# EAGLE design Varmo - Rev A1 (EAGLE 7.5.0)
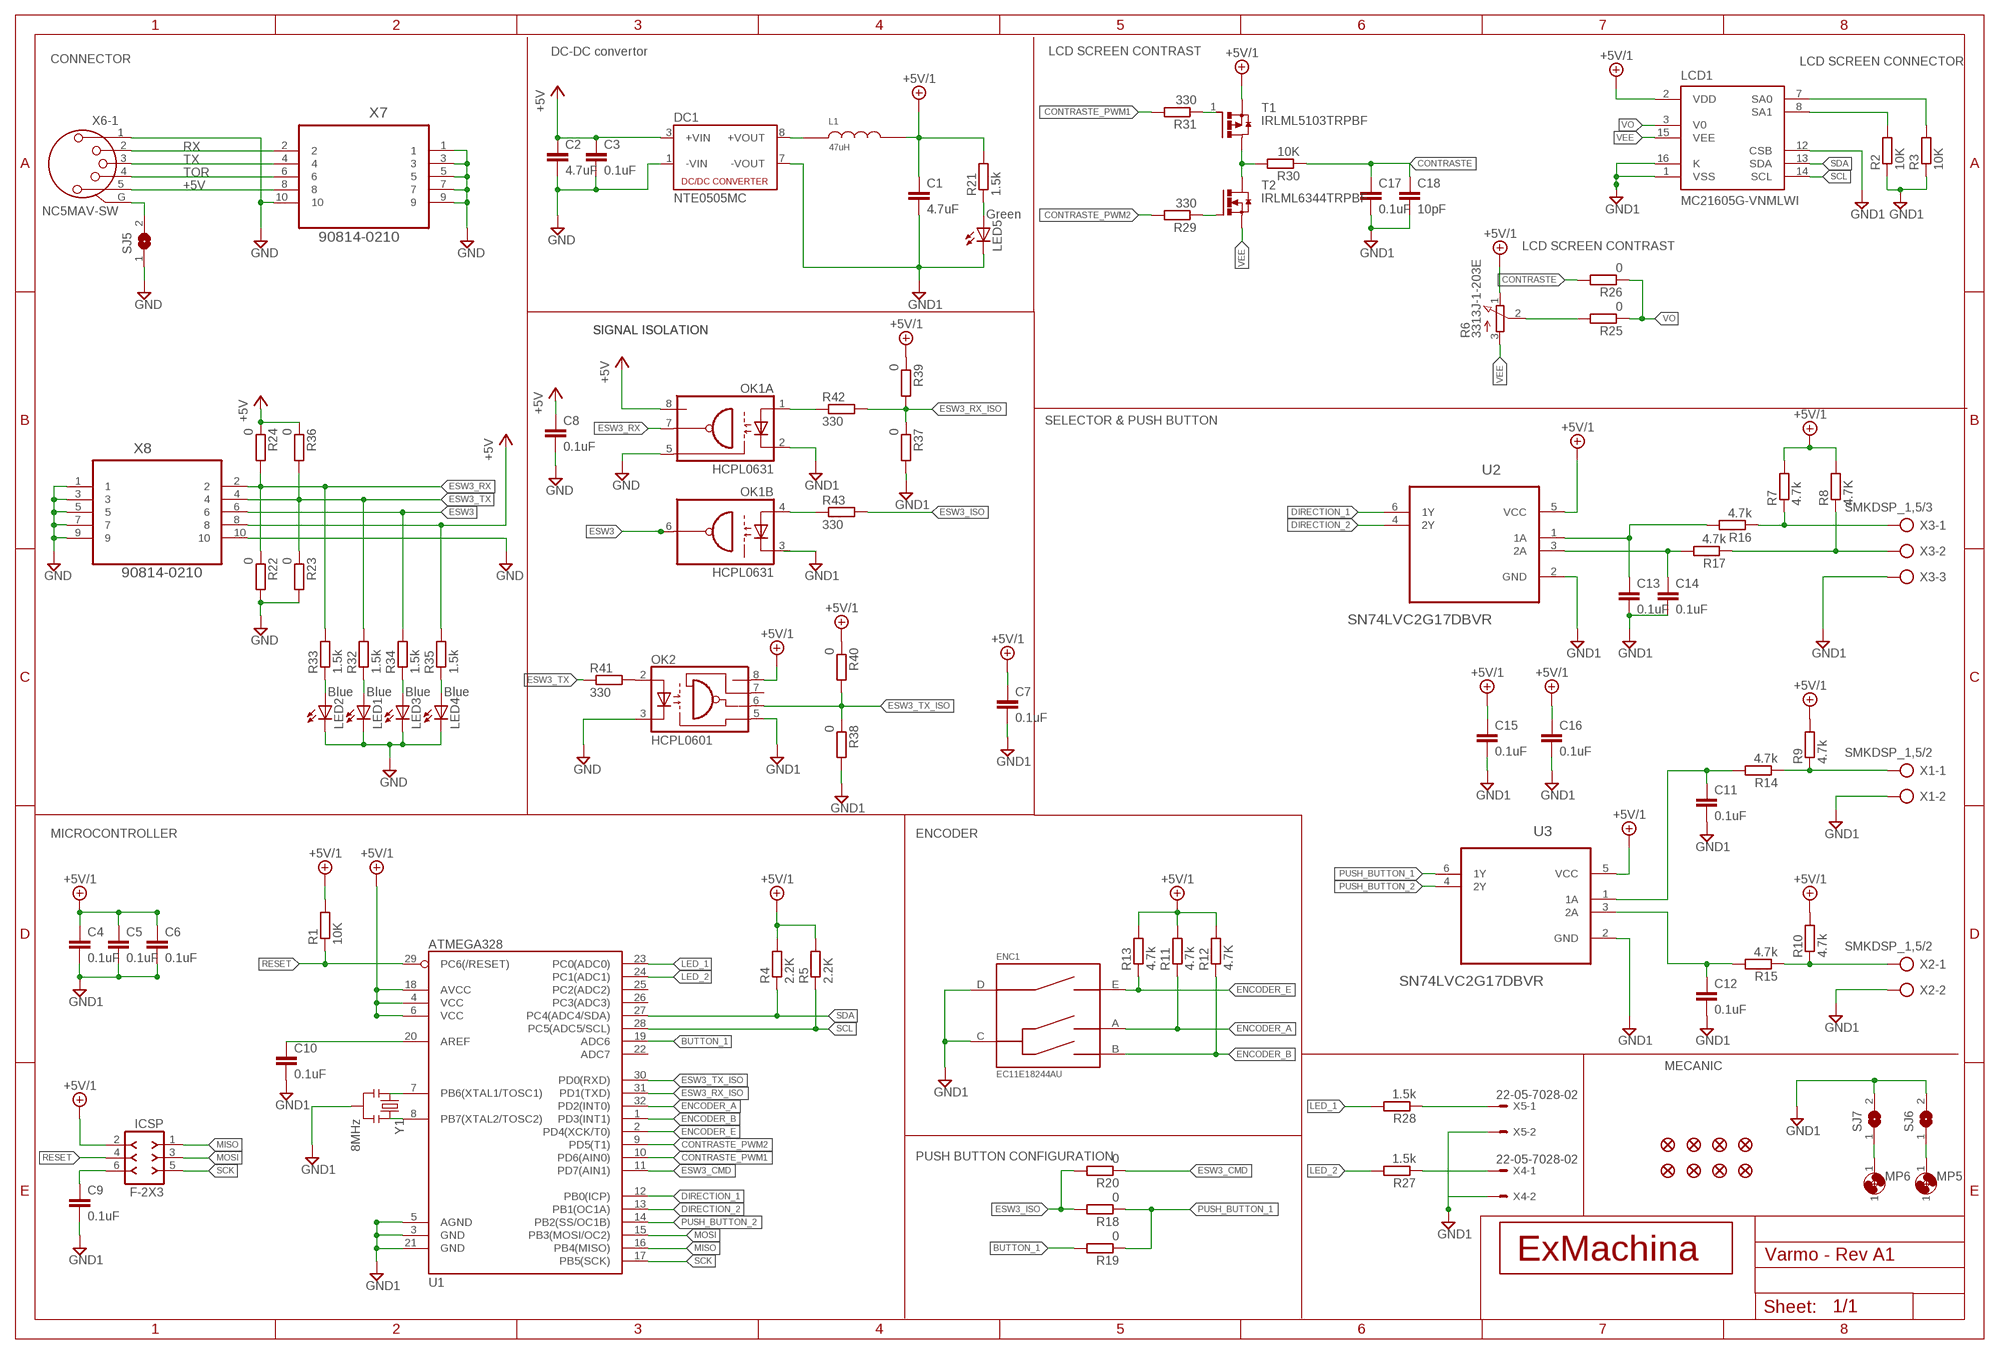
[diagram p0: schematic, sheet 1]

## Parts
C1  4.7uF  C-EUC0603  [C0603]
C2  4.7uF  C-EUC0603  [C0603]
C3  0.1uF  C-EUC0603  [C0603]
C4  0.1uF  C-EUC0603  [C0603]
C5  0.1uF  C-EUC0603  [C0603]
C6  0.1uF  C-EUC0603  [C0603]
C7  0.1uF  C-EUC0603  [C0603]
C8  0.1uF  C-EUC0603  [C0603]
C9  0.1uF  C-EUC0603  [C0603]
C10  0.1uF  C-EUC0603  [C0603]
C11  0.1uF  C-EUC0603  [C0603]
C12  0.1uF  C-EUC0603  [C0603]
C13  0.1uF  C-EUC0603  [C0603]
C14  0.1uF  C-EUC0603  [C0603]
C15  0.1uF  C-EUC0603  [C0603]
C16  0.1uF  C-EUC0603  [C0603]
C17  0.1uF  C-EUC0603  [C0603]
C18  10pF  C-EUC0603  [C0603]
DC1  NTE0505MC  [NTE]
ENC1  EC11E18244AU  [EC11E]
ICSP  F-2X3  [DIL-100-2X3]
JP3  FIDUCIAL1X2  [FIDUCIAL-1X2]
JP4  FIDUCIAL1X2  [FIDUCIAL-1X2]
JP5  FIDUCIAL1X2  [FIDUCIAL-1X2]
JP6  FIDUCIAL1X2  [FIDUCIAL-1X2]
JP7  FIDUCIAL1X2  [FIDUCIAL-1X2]
JP8  FIDUCIAL1X2  [FIDUCIAL-1X2]
JP9  FIDUCIAL1X2  [FIDUCIAL-1X2]
JP10  FIDUCIAL1X2  [FIDUCIAL-1X2]
L1  47uH  82473C  [8200]
LCD1  MC21605G-VNMLWI  [MC21605G]
LED1  Blue  LEDCHIP-LED0603  [CHIP-LED0603]
LED2  Blue  LEDCHIP-LED0603  [CHIP-LED0603]
LED3  Blue  LEDCHIP-LED0603  [CHIP-LED0603]
LED4  Blue  LEDCHIP-LED0603  [CHIP-LED0603]
LED5  Green  LEDCHIP-LED0603  [CHIP-LED0603]
MP5  MOUNT-PAD2.5  [P2.5]
MP6  MOUNT-PAD2.5  [P2.5]
OK1  HCPL0631  [SOIC08]
OK2  HCPL0601  [SOIC08]
R1  10K  R-EU_R0603  [R0603]
R2  10K  R-EU_R0603  [R0603]
R3  10K  R-EU_R0603  [R0603]
R4  2.2K  R-EU_R0603  [R0603]
R5  2.2K  R-EU_R0603  [R0603]
R6  3313J-1-203E  [3313J]
R7  4.7k  R-EU_R0603  [R0603]
R8  4.7K  R-EU_R0603  [R0603]
R9  4.7k  R-EU_R0603  [R0603]
R10  4.7k  R-EU_R0603  [R0603]
R11  4.7k  R-EU_R0603  [R0603]
R12  4.7K  R-EU_R0603  [R0603]
R13  4.7k  R-EU_R0603  [R0603]
R14  4.7k  R-EU_R0603  [R0603]
R15  4.7k  R-EU_R0603  [R0603]
R16  4.7k  R-EU_R0603  [R0603]
R17  4.7k  R-EU_R0603  [R0603]
R18  0  R-EU_R0603  [R0603]
R19  0  R-EU_R0603  [R0603]
R20  0  R-EU_R0603  [R0603]
R21  1.5k  R-EU_R0603  [R0603]
R22  0  R-EU_R0603  [R0603]
R23  0  R-EU_R0603  [R0603]
R24  0  R-EU_R0603  [R0603]
R25  0  R-EU_R0603  [R0603]
R26  0  R-EU_R0603  [R0603]
R27  1.5k  R-EU_R0603  [R0603]
R28  1.5k  R-EU_R0603  [R0603]
R29  330  R-EU_R0603  [R0603]
R30  10K  R-EU_R0603  [R0603]
R31  330  R-EU_R0603  [R0603]
R32  1.5k  R-EU_R0603  [R0603]
R33  1.5k  R-EU_R0603  [R0603]
R34  1.5k  R-EU_R0603  [R0603]
R35  1.5k  R-EU_R0603  [R0603]
R36  0  R-EU_R0603  [R0603]
R37  0  R-EU_R0603  [R0603]
R38  0  R-EU_R0603  [R0603]
R39  0  R-EU_R0603  [R0603]
R40  0  R-EU_R0603  [R0603]
R41  330  R-EU_R0603  [R0603]
R42  330  R-EU_R0603  [R0603]
R43  330  R-EU_R0603  [R0603]
SJ5  SJ  [SJ]
SJ6  SJ  [SJ]
SJ7  SJ  [SJ]
T1  IRLML5103TRPBF  [SOT95P240X112-3N]
T2  IRLML6344TRPBF  [SOT95P240X112-3N]
U1  ATMEGA328  ATMEGA168  [TQFP32-08]
U2  SN74LVC2G17DBVR  [SOT95P280X145-6N]
U3  SN74LVC2G17DBVR  [SOT95P280X145-6N]
U$6  EXMACHINA-LOGO-NAME  [EXM-LOGO-BASELINE]
X1  SMKDSP_1,5/2  [SMKDSP_1,5/2]
X2  SMKDSP_1,5/2  [SMKDSP_1,5/2]
X3  SMKDSP_1,5/3  [SMKDSP_1,5/3]
X4  22-05-7028-02  [7395-02]
X5  22-05-7028-02  [7395-02]
X6  NC5MAV-SW  [NC5MAV-SW]
X7  90814-0210  [MOLEX_90814-0210]
X8  90814-0210  [MOLEX_90814-0210]
Y1  8MHz  RESONATORSMD  [RESONATOR-SMD]

## Nets
+5V: C2.1 C3.1 C8.1 DC1.3(+VIN) OK1.8(A:VCC) R24.1 R35.2 R36.1 X6.5 X7.8 X8.8
+5V/1: C1.1 C4.1 C5.1 C6.1 C7.1 C15.1 C16.1 ICSP.2 L1.2 LCD1.2(VDD) OK2.8(VCC) R1.2 R4.2 R5.2 R6.1(E) R7.2 R8.2 R9.2 R10.2 R11.2 R12.2 R13.2 R21.2 R39.1 R40.1 T1.2(S) U1.4(VCC) U1.6(VCC) U1.18(AVCC) U2.5(VCC) U3.5(VCC)
BUTTON_1: R19.2 U1.19(ADC6)
CONTRASTE: C17.1 C18.1 R26.2 R30.1
CONTRASTE_PWM1: R31.2 U1.10(PD6(AIN0))
CONTRASTE_PWM2: R29.2 U1.9(PD5(T1))
DIRECTION_1: U1.12(PB0(ICP)) U2.6(1Y)
DIRECTION_2: U1.13(PB1(OC1A)) U2.4(2Y)
ENCODER_A: ENC1.A R11.1 U1.32(PD2(INT0))
ENCODER_B: ENC1.B R12.1 U1.1(PD3(INT1))
ENCODER_E: ENC1.E R13.1 U1.2(PD4(XCK/T0))
ESW3: OK1.6(B:VO2) R34.2 X8.6
ESW3_CMD: R20.1 U1.11(PD7(AIN1))
ESW3_ISO: R18.2 R20.2 R43.2
ESW3_RX: OK1.7(A:VO) R22.1 R24.2 R33.2 X8.2
ESW3_RX_ISO: R37.1 R39.2 R42.2 U1.31(PD1(TXD))
ESW3_TX: R23.1 R32.2 R36.2 R41.1 X8.4
ESW3_TX_ISO: OK2.6(VO) R38.1 R40.2 U1.30(PD0(RXD))
GND: C2.2 C3.2 C8.2 DC1.1(-VIN) LED1.C LED2.C LED3.C LED4.C OK1.5(A:GND) OK2.3(C) R22.2 R23.2 SJ5.1 X6.1 X7.1 X7.3 X7.5 X7.7 X7.9 X7.10 X8.1 X8.3 X8.5 X8.7 X8.9 X8.10
GND1: C1.2 C4.2 C5.2 C6.2 C7.2 C9.2 C10.2 C11.2 C12.2 C13.2 C14.2 C15.2 C16.2 C17.2 C18.2 DC1.7(-VOUT) ENC1.C ENC1.D LCD1.1(VSS) LCD1.12(CSB) LCD1.16(K) LED5.C OK1.2(A:C1) OK2.5(GND) R2.1 R3.1 R37.2 R38.2 SJ6.2 SJ7.2 U1.3(GND) U1.5(AGND) U1.21(GND) U2.2(GND) U3.2(GND) X1.2 X2.2 X3.3 X4.2 X5.2 Y1.2
LED_1: R28.2 U1.23(PC0(ADC0))
LED_2: R27.2 U1.24(PC1(ADC1))
MISO: ICSP.1 U1.16(PB4(MISO))
MOSI: ICSP.3 U1.15(PB3(MOSI/OC2))
N$1: DC1.8(+VOUT) L1.1
N$2: U1.7(PB6(XTAL1/TOSC1)) Y1.1
N$3: U1.8(PB7(XTAL2/TOSC2)) Y1.3
N$4: C9.1 ICSP.6
N$5: C10.1 U1.20(AREF)
N$6: R10.1 R15.1 X2.1
N$7: R9.1 R14.1 X1.1
N$8: R7.1 R16.1 X3.1
N$9: R8.1 R17.1 X3.2
N$10: C13.1 R16.2 U2.1(1A)
N$11: C14.1 R17.2 U2.3(2A)
N$12: C12.1 R15.2 U3.3(2A)
N$13: C11.1 R14.2 U3.1(1A)
N$14: R6.2(S) R25.2
N$15: R27.1 X4.1
N$16: R28.1 X5.1
N$17: R29.1 T2.1(G)
N$22: R30.2 T1.3(D) T2.3(D)
N$23: SJ5.2 X6.G(-1:G)
N$24: R31.1 T1.1(G)
N$29: LCD1.8(SA1) R2.2
N$30: LCD1.7(SA0) R3.2
N$31: LED1.A R32.1
N$32: LED2.A R33.1
N$33: LED3.A R34.1
N$34: LED4.A R35.1
N$35: LED5.A R21.1
N$37: OK1.1(A:A1) R42.1
N$38: OK1.4(B:A2) R43.1
N$39: OK2.2(A) R41.2
N$500: MP5.1 SJ6.1
N$501: MP6.1 SJ7.1
PUSH_BUTTON_1: R18.1 R19.1 U3.6(1Y)
PUSH_BUTTON_2: U1.14(PB2(SS/OC1B)) U3.4(2Y)
RESET: ICSP.4 R1.1 U1.29(PC6(/RESET))
RX: X6.2 X7.2
SCK: ICSP.5 U1.17(PB5(SCK))
SCL: LCD1.14(SCL) R5.1 U1.28(PC5(ADC5/SCL))
SDA: LCD1.13(SDA) R4.1 U1.27(PC4(ADC4/SDA))
TOR: X6.4 X7.6
TX: X6.3 X7.4
VEE: LCD1.15(VEE) R6.3(A) T2.2(S)
VO: LCD1.3(V0) R25.1 R26.1
Unconnected: OK1.3(B:C2) OK2.7(VE) U1.22(ADC7) U1.25(PC2(ADC2)) U1.26(PC3(ADC3)) X6.N(-2:N) X6.NC(-2:NC) X6.NO(-2:NO)

## Notes on the sheet
- DC-DC convertor | LCD SCREEN CONTRAST
- CONNECTOR | LCD SCREEN CONNECTOR
- LCD SCREEN CONTRAST
- SIGNAL ISOLATION | SIGNAL ISOLATION
- SELECTOR & PUSH BUTTON
- MICROCONTROLLER | ENCODER
- MECANIC
- PUSH BUTTON CONFIGURATION

## Library data of the parts
C1 C2 = rcl:C-EU: CAPACITOR, European symbol; MPN: MC0603X475K100CT; OC_NEWARK: 06X6198
C3-C17 = rcl:C-EU: CAPACITOR, European symbol; MPN: MC0603B104K160CT; OC_NEWARK: 06R4923
C18 = rcl:C-EU: CAPACITOR, European symbol; MPN: MC0603N100F500CT; OC_NEWARK: 06R5113
DC1 = dc-dc-converter:NTE; MF: C & D TECHNOLOGIES, INC; MPN: NTE0505MC; OC_NEWARK: 61K3399
ENC1 = encoder:EC11E?; MPN: EC11E18244AU; OC_FARNELL: 2064988; OC_NEWARK: 75T6685
ICSP = con-headers-jp:F-2X3; MPN: 2213S-06G; OC_NEWARK: 08N6789
JP3-JP10 = SparkFun:FIDUCIAL: Fiducial Alignment Points Various fiducial points for machine vision alignment.; OC_NEWARK: unknown
L1 = murata-inductance:82473C; MPN: 82473C; OC_NEWARK: 40M7122
LCD1 = midas:MC21605G-?; MPN: MC21605G12W-VNMLWI; OC_FARNELL: 2425704; OC_NEWARK: 61X9742
LED1-LED4 = led:LED: LED OSRAM: - CHIPLED LG R971, LG N971, LY N971, LG Q971, LY Q971, LO R971, LY R971 LH N974, LH R974 LS Q976, LO Q976, LY Q976 LO Q996 - Hyper CHIPLED LW Q18S LB Q993, LB Q99A, LB R99A - SideLED LS A670, LO A670, LY A670, LG A670, LP A670 LB A673, LV A673, LT A673, LW A673 LH A674 LY A675 LS A676, LA A676, LO A676, LY A676, LW A676 LS A679, LY A679, LG A679 - Hyper Micro SIDELED® LS Y876, LA Y876, LO Y876, LY Y876 LT Y87S - SmartLED LW L88C, LW L88S LB L89C, LB L89S, LG L890 LS L89K, LO L89K, LY L89K LS L896, LA L896, LO L896, LY L896 - TOPLED LS T670, LO T670, LY T670, LG T670, LP T670 LSG T670, LSP T670, LSY T670, LOP T670, LYG T670 LG T671, LOG T671, LSG T671 LB T673, LV T673, LT T673, LW T673 LH T674 LS T676, LA T676, LO T676, LY T676, LB T676, LH T676, LSB T676, LW T676 LB T67C, LV T67C, LT T67C, LS T67K, LO T67K, LY T67K, LW E67C LS E67B, LA E67B, LO E67B, LY E67B, LB E67C, LV E67C, LT E67C LW T67C LS T679, LY T679, LG T679 LS T770, LO T770, LY T770, LG T770, LP T770 LB T773, LV T773, LT T773, LW T773 LH T774 LS E675, LA E675, LY E675, LS T675 LS T776, LA T776, LO T776, LY T776, LB T776 LHGB T686 LT T68C, LB T68C - Hyper Mini TOPLED® LB M676 - Mini TOPLED Santana® LG M470 LS M47K, LO M47K, LY M47K Source: http://www.osram.convergy.de LUXEON: - LUMILED® LXK2-PW12-R00, LXK2-PW12-S00, LXK2-PW14-U00, LXK2-PW14-V00 LXK2-PM12-R00, LXK2-PM12-S00, LXK2-PM14-U00 LXK2-PE12-Q00, LXK2-PE12-R00, LXK2-PE12-S00, LXK2-PE14-T00, LXK2-PE14-U00 LXK2-PB12-K00, LXK2-PB12-L00, LXK2-PB12-M00, LXK2-PB14-N00, LXK2-PB14-P00, LXK2-PB14-Q00 LXK2-PR12-L00, LXK2-PR12-M00, LXK2-PR14-Q00, LXK2-PR14-R00 LXK2-PD12-Q00, LXK2-PD12-R00, LXK2-PD12-S00 LXK2-PH12-R00, LXK2-PH12-S00 LXK2-PL12-P00, LXK2-PL12-Q00, LXK2-PL12-R00 Source: www.luxeon.com KINGBRIGHT: KA-3528ASYC Source: www.kingbright.com; MPN: OVS-0603; OC_NEWARK: 15R2205
LED5 = led:LED: LED OSRAM: - CHIPLED LG R971, LG N971, LY N971, LG Q971, LY Q971, LO R971, LY R971 LH N974, LH R974 LS Q976, LO Q976, LY Q976 LO Q996 - Hyper CHIPLED LW Q18S LB Q993, LB Q99A, LB R99A - SideLED LS A670, LO A670, LY A670, LG A670, LP A670 LB A673, LV A673, LT A673, LW A673 LH A674 LY A675 LS A676, LA A676, LO A676, LY A676, LW A676 LS A679, LY A679, LG A679 - Hyper Micro SIDELED® LS Y876, LA Y876, LO Y876, LY Y876 LT Y87S - SmartLED LW L88C, LW L88S LB L89C, LB L89S, LG L890 LS L89K, LO L89K, LY L89K LS L896, LA L896, LO L896, LY L896 - TOPLED LS T670, LO T670, LY T670, LG T670, LP T670 LSG T670, LSP T670, LSY T670, LOP T670, LYG T670 LG T671, LOG T671, LSG T671 LB T673, LV T673, LT T673, LW T673 LH T674 LS T676, LA T676, LO T676, LY T676, LB T676, LH T676, LSB T676, LW T676 LB T67C, LV T67C, LT T67C, LS T67K, LO T67K, LY T67K, LW E67C LS E67B, LA E67B, LO E67B, LY E67B, LB E67C, LV E67C, LT E67C LW T67C LS T679, LY T679, LG T679 LS T770, LO T770, LY T770, LG T770, LP T770 LB T773, LV T773, LT T773, LW T773 LH T774 LS E675, LA E675, LY E675, LS T675 LS T776, LA T776, LO T776, LY T776, LB T776 LHGB T686 LT T68C, LB T68C - Hyper Mini TOPLED® LB M676 - Mini TOPLED Santana® LG M470 LS M47K, LO M47K, LY M47K Source: http://www.osram.convergy.de LUXEON: - LUMILED® LXK2-PW12-R00, LXK2-PW12-S00, LXK2-PW14-U00, LXK2-PW14-V00 LXK2-PM12-R00, LXK2-PM12-S00, LXK2-PM14-U00 LXK2-PE12-Q00, LXK2-PE12-R00, LXK2-PE12-S00, LXK2-PE14-T00, LXK2-PE14-U00 LXK2-PB12-K00, LXK2-PB12-L00, LXK2-PB12-M00, LXK2-PB14-N00, LXK2-PB14-P00, LXK2-PB14-Q00 LXK2-PR12-L00, LXK2-PR12-M00, LXK2-PR14-Q00, LXK2-PR14-R00 LXK2-PD12-Q00, LXK2-PD12-R00, LXK2-PD12-S00 LXK2-PH12-R00, LXK2-PH12-S00 LXK2-PL12-P00, LXK2-PL12-Q00, LXK2-PL12-R00 Source: www.luxeon.com KINGBRIGHT: KA-3528ASYC Source: www.kingbright.com; MPN: OVS-0604; OC_NEWARK: 15R2206
MP5 MP6 = holes:MOUNT-PAD: MOUNTING HOLE with drill center marker; OC_NEWARK: unknown
OK1 = optocoupler:HCPL0631
OK2 = optocoupler:HCPL0601: HEWLETT PACKARD OPTO COUPLER; MF: AGILENT TECHNOLOGIES; MPN: HCPL-0601-000E; OC_FARNELL: 9995102; OC_NEWARK: 88H7776
R1-R3 R30 = rcl:R-EU_: RESISTOR, European symbol; MPN: MCMR06X1002FTL; OC_NEWARK: 86T3506
R4 R5 = rcl:R-EU_: RESISTOR, European symbol; MPN: MCMR06X2201FTL; OC_NEWARK: 86T3578
R6 = pot:3313J; MPN: 3313J-1-203E; OC_NEWARK: 96M0897
R7-R17 = rcl:R-EU_: RESISTOR, European symbol; MPN: MCMR06X4701FTL; OC_NEWARK: 86T3649
R18-R20 R22-R26 R36-R43 = rcl:R-EU_: RESISTOR, European symbol; MPN: MCMR06X000 PTL; OC_NEWARK: 86T3500
R21 R27 R28 R32-R35 = rcl:R-EU_: RESISTOR, European symbol; MPN: MCMR06X1501FTL; OC_NEWARK: 86T3542
R29 R31 = rcl:R-EU_: RESISTOR, European symbol; MPN: MCMR06X3300FTL; OC_NEWARK: 86T3616
SJ5-SJ7 = jumper:SJ: SMD solder JUMPER; OC_NEWARK: unknown
T1 = International_Rectifier_By_element14_Batch_1:IRLML5103TRPBF; MF: INTERNATIONAL RECTIFIER(IR); MPN: IRLML5103TRPBF; OC_NEWARK: 63J7612
T2 = International_Rectifier_By_element14_Batch_1:IRLML6344TRPBF: Power MOSFET; MPN: IRLML6344TRPBF; OC_FARNELL: 1857299; OC_NEWARK: 25T5500; PACKAGE: SOT-23-3; SUPPLIER: INTERNATIONAL RECTIFIER
U1 = atmel:ATMEGA168; MPN: ATMEGA328P-AUR; OC_NEWARK: 87W8111
U2 U3 = ti:SN74LVC2G17DBVR: DUAL SCHMITT-TRIGGER BUFFER; MF: TEXAS INSTRUMENTS; MPN: SN74LVC2G17DBVR; OC_FARNELL: 1470776; OC_NEWARK: 76C4207; PACKAGE: SOT-23-6; SUPPLIER: Texas Instruments
U$6 = exmachina:EXMACHINA-LOGO
X1 X2 = con-phoenix-smkdsp:SMKDSP_1,5/2: Printklemme, Nennstrom: 17,5 A, Bemessungsspannung: 250 V, Raster: 5,0 mm Source: http://eshop.phoenixcontact.de .. 1733415.pdf; MF: FARNELL; MPN: 1733570; OC_FARNELL: 3041244; OC_NEWARK: 69C8588
X3 = con-phoenix-smkdsp:SMKDSP_1,5/3: Printklemme, Nennstrom: 17,5 A, Bemessungsspannung: 250 V, Raster: 5,0 mm Source: http://eshop.phoenixcontact.de .. 1733415.pdf; MF: FARNELL; MPN: 1733583; OC_FARNELL: 3041256; OC_NEWARK: 71C4130
X4 X5 = con-molex:22-?-02: CONNECTOR wire to board 2.54 mm (.1 inch) pitch header; MPN: 22-05-7028; OC_FARNELL: 9731601; OC_NEWARK: 25M1728
X6 = con-neutrik_ag:NC5?-SW: Neutrik Audio Connector XLR SERIES Stereo 1/4" jack Source: www.neutrik.com/; MPN: NC5MAV-SW; OC_FARNELL: unknown; OC_NEWARK: 31M5714
X7 X8 = Molex_By_element14_Batch_1:90814-0210: CONN HEADER 10POS 1.27MM SMD TIN; MPN: 90814-0210; OC_FARNELL: 1757026; OC_NEWARK: 34R6217; PACKAGE: CONN-10POS; SUPPLIER: Molex
Y1 = resonator:RESONATOR: Resonator Small SMD resonator. This is the itty bitty 10/20MHz resonators with built in caps. CSTCE10M0G55 and CSTCE20M0V53. Footprint for SMD has been used in SFE production for years, and does work okay. 1:1 is an attempt to get larger fillets on the sides so it will be easier to inspect these solders in our AOI machine. The pads have been minimized to match the actual metal under the resonator. To see this relation, it includes an image import of the bottom side of the component. Imported to scale on layer 200.; MPN: CSTCE8M00G55Z-R0; OC_NEWARK: 80P4001

## Board
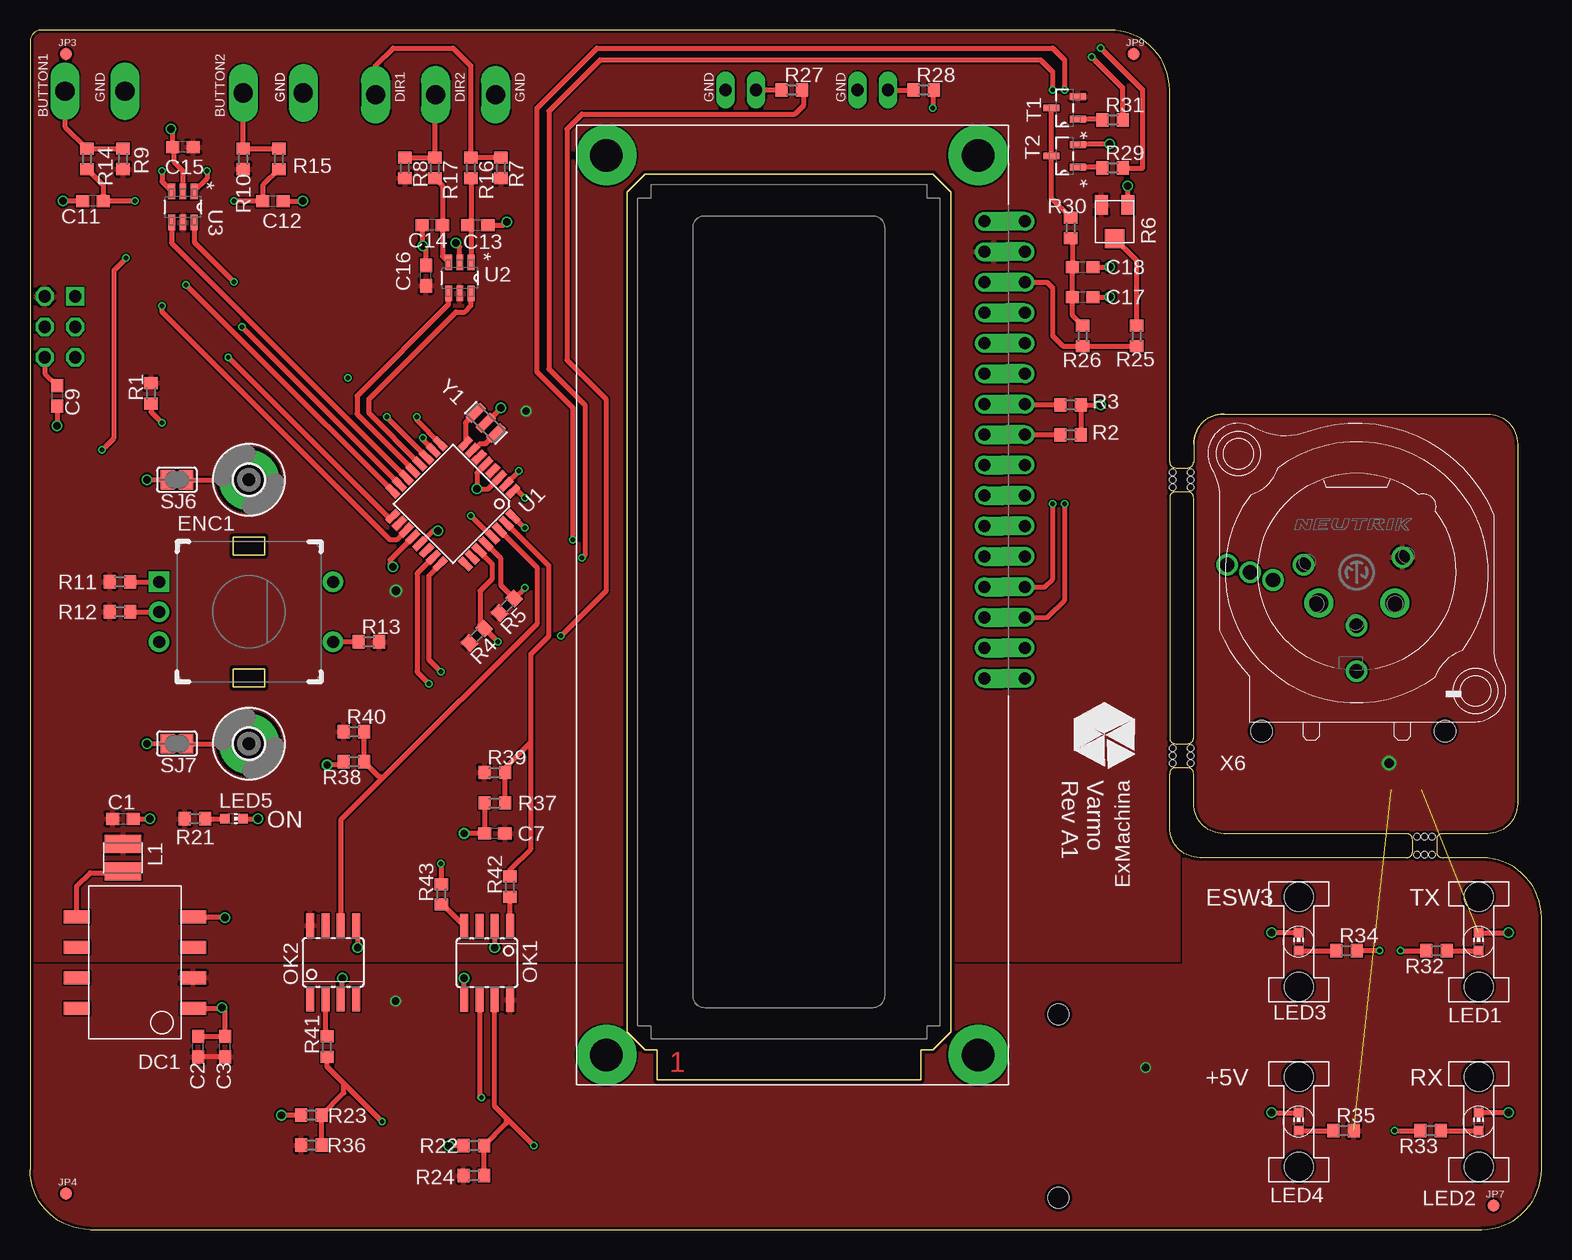
[diagram p1: board, top side]
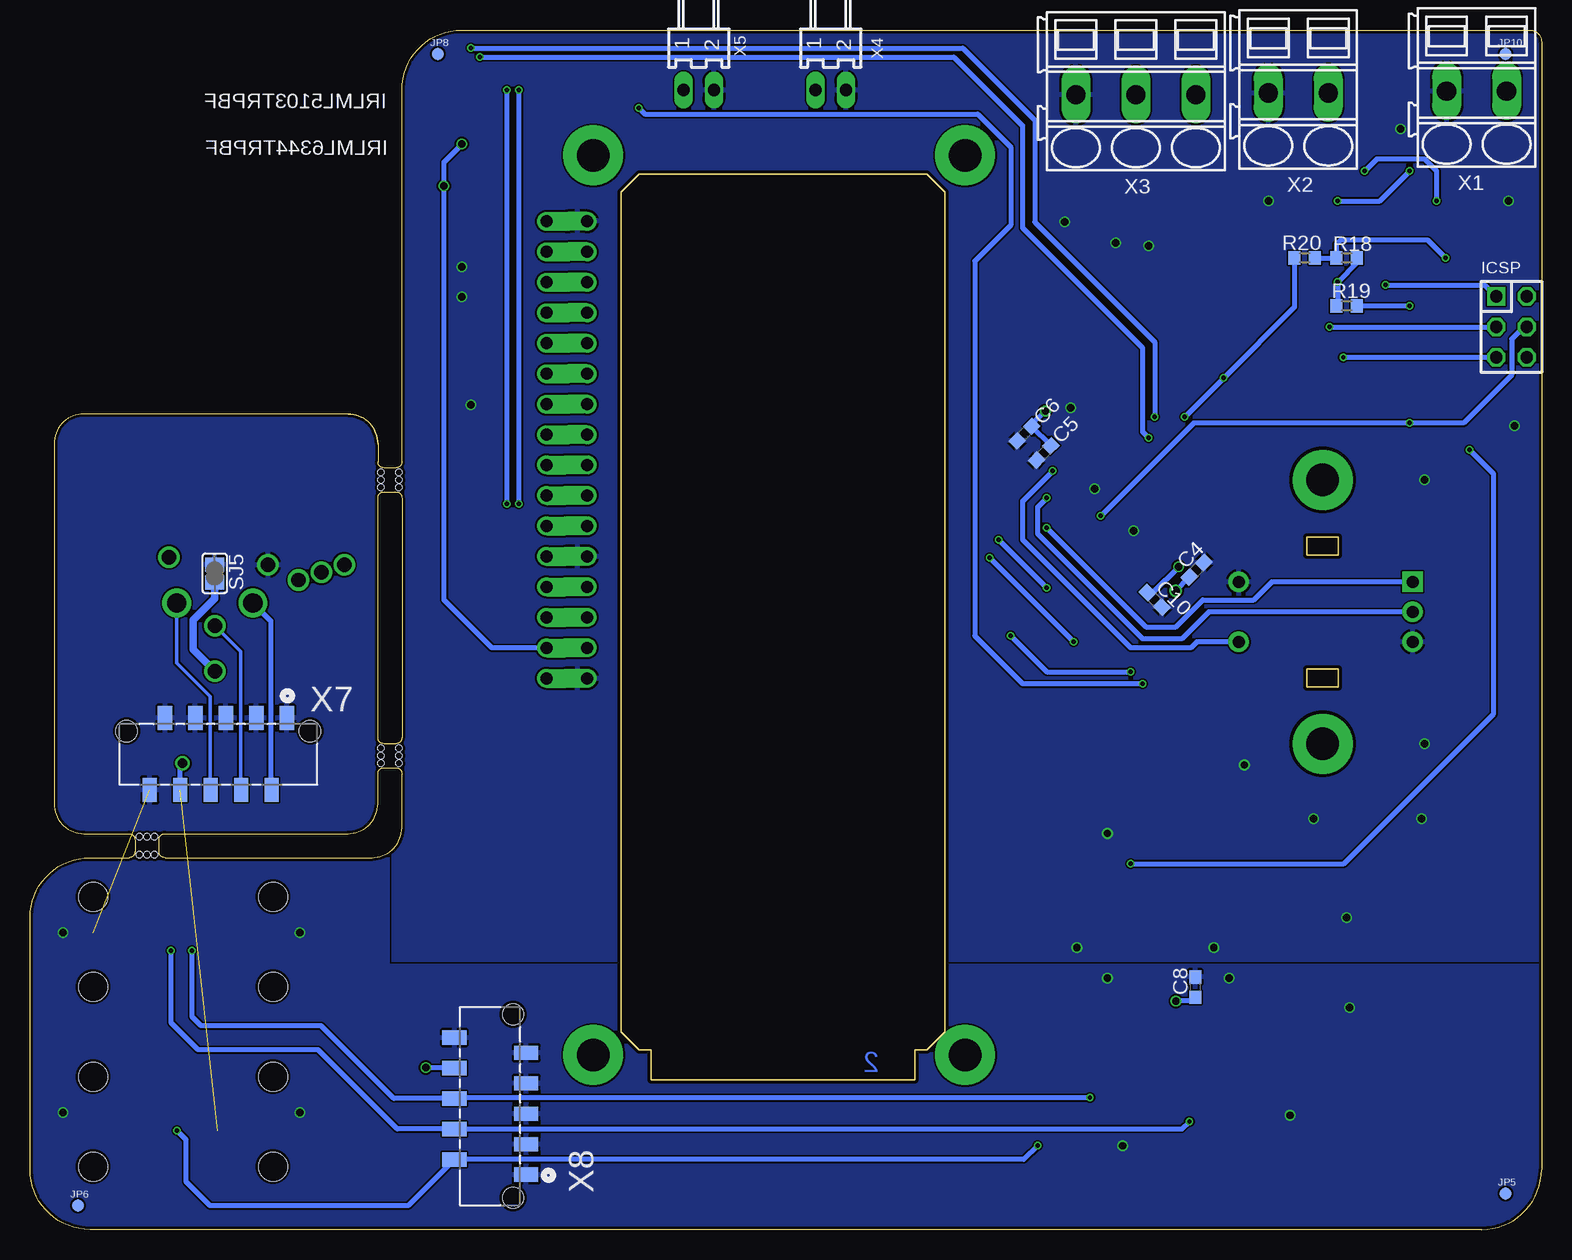
[diagram p2: board, bottom side, seen from below]

Size 126 x 100 mm. Coordinates in mm from the lower left corner, seen from the top.
Outline: 97,65.5 arc-90 99.5,68
Outline: 99.5,68 121.5,68 arc-90 124,65.5 124,35.5 arc-90 121.5,33 117.75,33 arc90 117.25,32.5 117.25,31.5 arc90 117.75,31 121,31 arc-90 126,26 126,5 arc-90 121,0 5,0 arc-90 0,5 0,99 arc-90 1,100 90,100 arc-90 95,95 95,64 arc90 95.5,63.5 96.5,63.5 arc90 97,64 97,65.5
Outline: 99.5,68 arc90 97,65.5
Outline: 114.75,33 99.5,33 arc-90 97,35.5 97,38 arc90 96.5,38.5 95.5,38.5 arc90 95,38 95,33.5 arc90 97.5,31 114.75,31 arc90 115.25,31.5 115.25,32.5 arc90 114.75,33
Outline: 95,41 arc90 95.5,40.5 96.5,40.5 arc90 97,41 97,61 arc90 96.5,61.5 95.5,61.5 arc90 95,61 95,41
Copper layers (1*16): Top 0.018mm / dielectric 1.55mm / Bottom 0.018mm
Design rules "eC_2Layer_PClass6_BaseCopperO18_eCDefault *": minimum track width 0.15mm, minimum drill 0.35mm, track to track 0.15mm, track to pad 0.15mm, pad to pad 0.15mm, via to via 0.15mm, smd to smd 0mil, copper to edge 0.25mm, drill to drill 0.35mm, minimum pad ring 0.175mm, minimum via ring 0.125mm, stop-mask expansion 0mil, vias tented up to drill 0.45mm, thermal gap 0.2mm
Holes 0.5 mm at 96.75,38.88 96.75,40.12 96.75,39.5 95.25,38.88 95.25,39.5 95.25,40.12 96.75,61.88 96.75,63.12 96.75,62.5 95.25,61.88 95.25,62.5 95.25,63.12 115.62,31.25 116.88,31.25 116.25,31.25 115.62,32.75 116.25,32.75 116.88,32.75

### Footprints (pad centres in the part's own frame; a part is rotated, then mirrored left to right if it is on the bottom)
C0603 = smd 1.1 x 1: 1 -0.85,0; 2 0.85,0
NTE = smd 1.067 x 2.184: 1 -3.81,-4.85; 3 -1.27,-4.85; 5 1.27,-4.85; 7 3.81,-4.85; 8 3.81,4.85; 10 1.27,4.85; 12 -1.27,4.85; 14 -3.81,4.85
EC11E = drill 1 pad 1.7 square: A -2.5,-7.5 | drill 1 pad 1.7: B 0,-7.5; C 2.5,-7.5; D -2.5,7; E 2.5,7
DIL-100-2X3 = drill 1.016 square: 1 -2.54,-1.27 | drill 1.016 octagon: 2 -2.54,1.27; 3 0,-1.27; 4 0,1.27; 5 2.54,-1.27; 6 2.54,1.27
FIDUCIAL-1X2 = smd 1 x 1: 1 0,0
8200 = smd 3.05 x 1.52: 1 0,1.145; 2 0,-1.145
MC21605G = drill 1 pad 1.6 offset: 1 -32.55,16.3; 2 -30.01,16.3; 3 -27.47,16.3; 4 -24.93,16.3; 5 -22.39,16.3; 6 -19.85,16.3; 7 -17.31,16.3; 8 -14.77,16.3; 9 -12.23,16.3; 10 -9.69,16.3; 11 -7.15,16.3; 12 -4.61,16.3; 13 -2.07,16.3; 14 0.47,16.3; 15 3.01,16.3; 16 5.55,16.3; 17 5.55,19.7; 18 3.01,19.7; 19 0.47,19.7; 20 -2.07,19.7; 21 -4.61,19.7; 22 -7.15,19.7; 23 -9.69,19.7; 24 -12.23,19.7; 25 -14.77,19.7; 26 -17.31,19.7; 27 -19.85,19.7; 28 -22.39,19.7; 29 -24.93,19.7; 30 -27.47,19.7; 31 -30.01,19.7; 32 -32.55,19.7 | drill 2.7 pad 5: 33 -38.05,15.8; 34 -38.05,-15.2; 35 36.95,-15.2; 36 36.95,15.8
CHIP-LED0603 = smd 0.8 x 0.8: A 0,-0.75; C 0,0.75
P2.5 = drill 2.7 pad 5: 1 0,0
SOIC08 = smd 0.66 x 2.032: 1 -1.905,-3.073; 2 -0.635,-3.073; 3 0.635,-3.073; 4 1.905,-3.073; 5 1.905,3.073; 6 0.635,3.073; 7 -0.635,3.073; 8 -1.905,3.073
R0603 = smd 1 x 1.1: 1 -0.85,0; 2 0.85,0
3313J = smd 1.1 x 1.6: 1 1.1,-1.4; 3 -1.1,-1.4 | smd 1.6 x 1.6: 2 0,1.4
SJ = smd 1.168 x 1.6: 1 -0.762,0; 2 0.762,0
SOT95P240X112-3N = smd 1.321 x 0.559: 1 -1.092,0.94; 2 -1.092,-0.94; 3 1.092,0
TQFP32-08 = smd 1.27 x 0.559: 1 -4.293,2.8; 2 -4.293,2; 3 -4.293,1.2; 4 -4.293,0.4; 5 -4.293,-0.4; 6 -4.293,-1.2; 7 -4.293,-2; 8 -4.293,-2.8; 17 4.293,-2.8; 18 4.293,-2; 19 4.293,-1.2; 20 4.293,-0.4; 21 4.293,0.4; 22 4.293,1.2; 23 4.293,2; 24 4.293,2.8 | smd 0.559 x 1.27: 9 -2.8,-4.293; 10 -2,-4.293; 11 -1.2,-4.293; 12 -0.4,-4.293; 13 0.4,-4.293; 14 1.2,-4.293; 15 2,-4.293; 16 2.8,-4.293; 25 2.8,4.293; 26 2,4.293; 27 1.2,4.293; 28 0.4,4.293; 29 -0.4,4.293; 30 -1.2,4.293; 31 -2,4.293; 32 -2.8,4.293
SOT95P280X145-6N = smd 1.27 x 0.559: 1 -1.295,0.94; 2 -1.295,0; 3 -1.295,-0.94; 4 1.295,-0.94; 5 1.295,0; 6 1.295,0.94
1275.100 = hole 2.4: 3.75,0; -3.75,0
SMKDSP_1,5/2 = drill 1.6 pad 1.8 long: 1 -2.5,0; 2 2.5,0
SMKDSP_1,5/3 = drill 1.6 pad 1.8 long: 1 -2.5,0; 2 2.5,0; 3 7.5,0
7395-02 = drill 1.016 long: 1 1.27,0; 2 -1.27,0
NC5MAV-SW = drill 1.2: 1 -4.445,0.635; 3 0,-4.445; 5 3.81,1.27; G 0,-8.225; N -8.89,0; NC -6.985,-0.635; NO -10.795,0.635 | drill 1.6: 2 -3.175,-2.54; 4 3.175,-2.54
MOLEX_90814-0210 = smd 1.194 x 2.007: 1 0,0; 2 1.27,5.994; 3 2.54,0; 4 3.81,5.994; 5 5.08,0; 6 6.35,5.994; 7 7.62,0; 8 8.89,5.994; 9 10.16,0; 10 11.43,5.994 | hole 1.753: -1.93,1.092; 13.36,1.092
RESONATOR-SMD = smd 0.7 x 1.7: 1 -1.2,0; 2 0,0; 3 1.2,0

### Placement (x,y rotation side)
C1  7.75,34.25 0 top
C2  14,15.25 90 top
C3  16.25,15.25 90 top
C4  28.75,55 45 bottom
C5  41.49,64.74 225 bottom
C6  43.11,66.36 225 bottom
C7  38.73,33.02 180 top
C8  28.85,20.19 90 bottom
C9  2.25,69.5 270 top
C10  32.25,52.5 315 bottom
C11  5.25,85.75 180 top
C12  20.25,85.75 0 top
C13  37.32,83.75 0 top
C14  33.53,83.75 180 top
C15  12.75,90.25 180 top
C16  33,79.52 90 top
C17  87.75,77.75 0 top
C18  87.75,80.25 0 top
DC1  8.75,22.25 90 top
ENC1  18.25,51.5 270 top
ICSP  2.5,75.25 270 bottom
JP3  3,98 0 top
JP4  3,3 0 top
JP5  3,3 0 bottom
JP6  122,2 0 bottom
JP7  122,2 0 top
JP8  92,98 0 bottom
JP9  92,98 0 top
JP10  3,98 0 bottom
L1  7.75,31 180 top
LCD1  63.25,51.5 270 top
LED1  120.75,24 0 top
LED2  120.75,9 0 top
LED3  105.75,24 0 top
LED4  105.75,9 0 top
LED5  17,34.25 270 top
MP5  18.25,62.5 270 top
MP6  18.25,40.5 270 top
OK1  38.1,22.23 180 top
OK2  25.27,22.27 0 top
R1  10.09,69.7 90 top
R2  86.75,66.25 180 top
R3  86.75,68.75 180 top
R4  37.25,49.5 225 top
R5  39.75,52 225 top
R6  90.42,84.01 180 top
R7  39.25,88.5 270 top
R8  31.25,88.5 270 top
R9  7.75,89.25 270 top
R10  17.77,89.25 270 top
R11  7.5,54 180 top
R12  7.5,51.5 180 top
R13  28.25,49 0 top
R14  4.75,89.25 270 top
R15  20.75,89.25 270 top
R16  36.75,88.5 270 top
R17  33.75,88.5 270 top
R18  16.25,81 180 bottom
R19  16.25,77 0 bottom
R20  19.75,81 0 bottom
R21  13.75,34.25 180 top
R22  37,7 180 top
R23  23.46,9.54 180 top
R24  37,4.5 0 top
R25  92.25,74.5 90 top
R26  87.75,74.5 90 top
R27  63.5,95 0 top
R28  74.5,95 0 top
R29  90.25,88.5 0 top
R30  86.75,83.5 90 top
R31  90.25,92.5 0 top
R32  117.25,23.25 180 top
R33  116.75,8.25 180 top
R34  109.75,23.25 0 top
R35  109.5,8.25 0 top
R36  23.46,7.04 0 top
R37  38.73,35.56 180 top
R38  27,39 180 top
R39  38.73,38.1 0 top
R40  27,41.5 0 top
R41  24.77,15.24 90 top
R42  40.01,28.57 90 top
R43  34.29,27.94 90 top
SJ5  110.6,54.69 270 bottom
SJ6  12.25,62.5 180 top
SJ7  12.25,40.5 180 top
T1  86.25,93.5 180 top
T2  86.25,89.5 180 top
U1  35.25,60.5 225 top
U2  35.83,79.33 270 top
U3  12.75,85.25 270 top
U$1  [A4L-LOC]  -69.22,-48.9 0 top  (outside the outline)
U$2  [1275.100]  120.75,9 90 top
U$3  [1275.100]  105.75,24 270 top
U$4  [1275.100]  120.75,24 270 top
U$5  [1275.100]  105.75,9 270 top
U$6  89.53,41.27 270 top
X1  5.41,94.9 180 bottom
X2  20.28,94.75 180 bottom
X3  31.31,94.6 180 bottom
X4  59.25,95 180 bottom
X5  70.25,95 180 bottom
X6  110.6,54.78 0 top
X7  104.59,42.64 180 bottom
X8  84.63,4.57 90 bottom
Y1  38,67.25 135 top

### Tracks (layer width: path | path; a pad name or v marks a point on that pad's centre or on a via)
+5V  (via drill 0.6, 0.8)  (1 unrouted)
  Top 0.406: C3.1 C2.1
  Bottom 0.406: X8.8 92.96,13.46 v93,13.5 | C8.1 29.15,19.05 v30.48,19.05 | X7.8 113.48,38.67 v113.28,38.86
  pour Top: -4,22 96.25,22 96.25,74.5 131,74.5 131,-6 -4,-6
+5V/1  (via drill 0.6, 0.7)
  Bottom 0.406: v30.5,53.25 C4.1 | C5.1 C6.1 42.51,67.09 v41.37,68.23
  pour Top (rank 2): -9.75,111.5 -9.75,-12.5 arc-45 -9.59,-12.75 140,-13 140,111.5
BUTTON_1  (via drill 0.35)
  Top 0.406: U1.19 30.55,57.5 30,57.5 11,76.5 v11,77
  Bottom 0.406: v11,77 R19.2
CONTRASTE
  Top 0.406: R30.1 86.9,82.5 C18.1 C17.1 86.9,76.2 R26.2
CONTRASTE_PWM1  (via drill 0.35)
  Top 0.406: U1.10 32.75,65.83 v32.75,66 | R31.2 91.1,95.15 v88.5,97.75
  Bottom 0.406: v88.5,97.75 49,97.75 43.25,92 43.25,83.5 33.25,73.5 33.25,66.5 v32.75,66
CONTRASTE_PWM2  (via drill 0.35)
  Top 0.406: R29.2 92.75,88.5 92.75,95 v89.25,98.5 | U1.9 32.25,67.46 v32.25,67.75
  Bottom 0.406: v89.25,98.5 48.25,98.5 42.25,92.5 42.25,84 32.25,74 v32.25,67.75
DIRECTION_1
  Top 0.406: U2.6 36.77,77.02 36.25,76.5 35.5,76.5 28.25,69.25 28.25,68.07 U1.12
DIRECTION_2
  Top 0.406: U1.13 31.93,63.32 27.25,68 27.25,69.5 34.89,77.14 U2.4
ENCODER_A  (via drill 0.35)
  Top 0.406: v41.25,58.5 41.21,58.5 U1.32 | R11.1 ENC1.A
  Bottom 0.406: ENC1.A 22.5,54 24,52.5 28.25,52.5 30.5,50.25 33,50.25 v41.25,58.5
ENCODER_B  (via drill 0.35)
  Top 0.406: 40.27,61.48 U1.1 40.7,61.55 v41.25,61 | R12.1 ENC1.B
  Bottom 0.406: ENC1.B 27.75,51.5 30,49.25 33.25,49.25 42,58 42,60.25 v41.25,61
ENCODER_E  (via drill 0.35)
  Top 0.406: U1.2 39.7,62.2 v40.75,63.25 | R13.1 ENC1.E
  Bottom 0.406: ENC1.E 28.75,49 29.25,48.5 34.25,48.5 43.25,57.5 43.25,60.75 v40.75,63.25
ESW3  (via drill 0.35)
  Top 0.406: v112.5,23.25 R34.2 | OK1.6 37.47,11 v37.63,11
  Bottom 0.406: v37.63,11 90.54,11 X8.6 95.67,10.92 101.75,17 111.75,17 112.5,17.75 v112.5,23.25
ESW3_CMD  (via drill 0.35)
  Top 0.406: U1.11 29.75,67.7 v29.75,67.75
  Bottom 0.406: v29.75,67.75 v26.5,71 20.6,76.9 R20.1
ESW3_ISO  (via drill 0.35)
  Top 0.406: v6,65 7,66 7,80 v8,81 | v34.25,30.5 34.25,28.83 R43.2
  Bottom 0.406: R20.2 R18.2 17.1,82.15 16.75,82.5 9.5,82.5 v8,81 | v34.25,30.5 16.5,30.5 4,43 4,63 v6,65
ESW3_RX  (via drill 0.35)
  Top 0.406: 39.74,9.26 38.73,10.27 OK1.7 | 39.74,9.26 v42,7 | v113.75,8.25 R33.2 | R24.2 R22.1 39.74,8.89 39.74,9.26
  Bottom 0.406: v42,7 43.16,5.84 X8.2 94.46,2 111,2 113,4 113,7.5 v113.75,8.25
ESW3_RX_ISO
  Top 0.406: U1.31 43.25,55.33 43.25,49.5 41.75,48 41.75,40.64 | 41.75,40.64 41.75,31.75 40.01,30 R42.2 | R37.1 R39.2 39.59,38.48 41.75,40.64
ESW3_TX  (via drill 0.35)
  Top 0.406: 26.16,12.19 24.79,13.56 24.77,13.59 R41.1 | v114.25,23.25 R32.2 | R36.2 R23.1 26.16,11.39 26.16,12.19 | v29.35,9 26.16,12.19
  Bottom 0.406: v29.35,9 29.97,8.38 X8.4 95.38,8.38 102,15 112,15 114.25,17.25 v114.25,23.25
ESW3_TX_ISO
  Top 0.406: U1.30 42.25,55.2 42.25,50.5 29.53,37.78 | 29.53,37.78 25.91,34.16 OK2.6 | R40.2 R38.1 29.07,37.78 29.53,37.78
GND  (via drill 0.6)  (1 unrouted)
  Top 0.406: v103.5,9.75 LED4.C | LED3.C v103.5,24.75 | DC1.1 16,18.44 v16,18.5 16.25,18.25 C3.2 C2.2 | v123.25,9.75 LED2.C | LED1.C v123.25,24.75 | OK2.3 26.04,19.33 v26.04,20.95 | R23.2 22.59,9.53 v20.95,9.53 | OK1.5 v36.2,20.95 | R22.2 36.13,6.99 v34.92,6.99
  pour Bottom: -4,22 -4,-6 131,-6 131,74.5 96.25,74.5 96.25,22
GND1  (via drill 0.6)
  Top 0.406: Y1.2 v39.25,68.5 | C13.2 39.5,83.75 v39.75,84 | U2.2 35.83,81.92 v35.5,82.25 | C11.2 v2.75,85.75 | DC1.7 16.19,26.06 v16.25,26 | U1.5 37.25,63.07 v37.25,61.75 38.2,61.75 U1.3 | U1.21 33.57,58.25 v34,58.25 | C1.2 v10,34.25 | SJ6.2 v9.75,62.5 | SJ7.2 v9.75,40.5 | C9.2 v2.25,67 | LED5.C v19,34.25 | 22.5,85.75 C12.2 v22.75,85.75 | U3.2 12.75,88.25 12,89 12,90.15 C15.2 11.9,91.6 v11.75,91.75 | C18.2 v90,80.25 | C17.2 v90,77.75 | R2.1 R3.1 v89.25,68.75 | C16.2 33,81.75 v32.75,82 32.68,82.07 C14.2 | v36.2,33.02 C7.2 R37.2 | OK1.2 v38.73,23.5 | R38.2 25.89,38.73 v24.77,38.73 | OK2.5 27.3,25.22 v27.3,23.5
  pour Bottom (rank 2): -9.75,111.5 -9.75,-12.5 140,-13 140,111.5
LED_1  (via drill 0.35)
  Top 0.406: U1.23 32.25,54.67 32.25,46.5 v33.25,45.5 | R28.2 75.25,94.9 v75.25,93.5
  Bottom 0.406: v75.25,93.5 74.75,93 47,93 44.25,90.25 44.25,83.75 47.25,80.75 47.25,49.5 43.25,45.5 v33.25,45.5
LED_2  (via drill 0.35)
  Top 0.406: v44.25,49.5 48,53.25 48,69.25 44.75,72.5 44.75,91.75 46,93 63.75,93 64.5,93.75 64.5,94.85 R27.2 | v34.25,46.5 33.25,47.5 33.25,54.5 34.2,55.45 U1.24
  Bottom 0.406: v44.25,49.5 41.25,46.5 v34.25,46.5
MISO  (via drill 0.35)
  Top 0.406: U1.16 19.29,72.5 19.25,72.5 v13,78.75
  Bottom 0.406: v13,78.75 4.75,78.75 3.79,77.79 ICSP.1
MOSI  (via drill 0.35)
  Top 0.406: 30.8,62.2 U1.15 v17.67,75.25
  Bottom 0.406: v17.67,75.25 ICSP.3
N$1
  Top 0.406: DC1.8 3.9,28.65 5,29.75 7.64,29.75 L1.1
N$2
  Top 0.406: Y1.1 37.95,65.5 37.5,65.5 36.95,64.95 U1.7
N$3
  Top 0.406: Y1.3 36.3,67.25 U1.8
N$4
  Top 0.406: ICSP.6 1.23,71.37 C9.1
N$5  (via drill 0.6)
  Top 0.406: v30.25,55.25 30,55.5 30,55.82 U1.20
  Bottom 0.406: v30.25,55.25 32.4,53.1 C10.1
N$6
  Top 0.406: R15.1 R10.1 X2.1
N$7
  Top 0.406: X1.1 2.91,91.94 R14.1 R9.1
N$8
  Top 0.406: R7.1 R16.1 36.75,97 35.25,98.5 30.25,98.5 28.81,97.06 X3.1
N$9
  Top 0.406: R8.1 R17.1 33.75,94.54 X3.2
N$10
  Top 0.406: R16.2 36.75,84.03 C13.1 36.77,83.75 U2.1
N$11
  Top 0.406: R17.2 34.38,87.02 C14.1 34.38,81.14 U2.3
N$12  (via drill 0.35)
  Top 0.406: R15.2 19.4,87.05 C12.1 v17,85.75 | v11,88.25 11,87.36 U3.3
  Bottom 0.406: v17,85.75 13.5,85.75 v11,88.25
N$13  (via drill 0.35)
  Top 0.406: R14.2 6.1,87.05 6.1,86.25 | 6.1,86.25 C11.1 | v14.75,88.25 14.75,87.61 U3.1 | v8.75,85.75 6.6,85.75 6.1,86.25
  Bottom 0.406: v8.75,85.75 8.75,88.25 9.75,89.25 13.75,89.25 v14.75,88.25
N$14
  Top 0.406: R25.2 92.25,80.78 R6.2
N$15
  Top 0.406: R27.1 X4.1
N$16
  Top 0.406: X5.1 R28.1
N$17
  Top 0.406: R29.1 89.34,88.56 T2.1
N$22
  Top 0.406: R30.2 85.16,85.94 T2.3 T1.3
N$23
  Bottom 0.61: X6.G 112.39,48.35 112.39,50.8 110.6,52.59 SJ5.2
N$24
  Top 0.406: R31.1 89.34,92.56 T1.1
N$29
  Top 0.406: R2.2 79.57,66.25 LCD1.8
  Bottom 0.406: 79.57,66.25 LCD1.8
N$30
  Top 0.406: R3.2 79.61,68.75 LCD1.7
  Bottom 0.406: 79.61,68.75 LCD1.7
N$31
  Top 0.406: R32.1 LED1.A
N$32
  Top 0.406: R33.1 LED2.A
N$33
  Top 0.406: LED3.A R34.1
N$34
  Top 0.406: LED4.A R35.1
N$35
  Top 0.406: R21.1 LED5.A
N$37
  Top 0.406: OK1.1 R42.1
N$38
  Top 0.406: OK1.4 34.4,27.09 R43.1
N$39
  Top 0.406: OK2.2 24.64,16.6 24.77,16.48 R41.2
N$500
  Top 0.406: SJ6.1 MP5.1
N$501
  Top 0.406: SJ7.1 MP6.1
PUSH_BUTTON_1  (via drill 0.35)
  Top 0.406: U3.6 13.69,82.31 v17,79
  Bottom 0.406: R18.1 15.4,80.6 v17,79 17,77.1 R19.1
PUSH_BUTTON_2
  Top 0.406: U3.4 11.81,82.24 U1.14
RESET  (via drill 0.35)
  Top 0.406: U1.29 38.5,57.75 v36.75,59.5 | R1.1 10.09,68.16 v11,67.25
  Bottom 0.406: ICSP.4 1.5,75.25 2.5,74.25 2.5,71.25 6.5,67.25 v11,67.25 29,67.25 v36.75,59.5
RX
  Bottom 0.406: X6.2 105.92,50.73 105.92,36.7 X7.2
SCK  (via drill 0.35)
  Top 0.406: 30.25,59.5 30.2,59.45 U1.17 29.79,59.45 v16.53,72.71
  Bottom 0.406: v16.53,72.71 ICSP.5
SCL  (via drill 0.35)
  Top 0.406: U1.28 39.25,55.93 39.25,53.7 R5.1 v41.25,53.5 | v45.25,57.5 45.25,68.5 42.25,71.5 42.25,93.5 47.25,98.5 85.25,98.5 86.25,97.5 v86.25,95 | LCD1.14 84.78,51.03 86.25,52.5 v86.25,60.5
  Bottom 0.406: v41.25,53.5 v45.25,57.5 | v86.25,60.5 v86.25,95
SDA  (via drill 0.35)
  Top 0.406: U1.27 37.44,56.56 38.5,55.5 38.5,54.25 37.5,53.25 37.5,50.45 R4.1 | v39,49 37.9,50.1 R4.1 | LCD1.13 84.57,53.57 85.25,54.25 v85.25,60.5 | v85.25,95 85.25,96.5 84.25,97.5 47.5,97.5 43.25,93.25 43.25,71.75 46.25,68.75 46.25,56.25 v46,56 | R4.1
  Bottom 0.406: v46,56 v39,49 | v85.25,60.5 v85.25,95
TOR
  Bottom 0.305: X6.4 113.78,47.23 111,44.45 111,36.7 X7.6
TX
  Bottom 0.305: X6.3 108.46,48.19 108.46,36.7 X7.4
VEE  (via drill 0.6)
  Top 0.406: v90,90.5 87.4,90.5 T2.2 | R6.3 91.52,86.98 v91.5,87
  Bottom 0.406: LCD1.15 87.49,48.49 91.5,52.5 v91.5,87 91.5,89 v90,90.5
VO
  Top 0.406: R25.1 R26.1 86.1,73.65 85.25,74.5 85.25,78.5 84.78,78.97 LCD1.3

### Text on the board
Top: 1
Bottom: 2
tPlace: GND | GND | GND | DIR1 | DIR2 | GND | GND | GND | BUTTON1 | BUTTON2 | Varmo / Rev A1 | ON | ESW3 | TX | +5V | RX